# Altium project ADC_Klipper_Board.PrjPcb
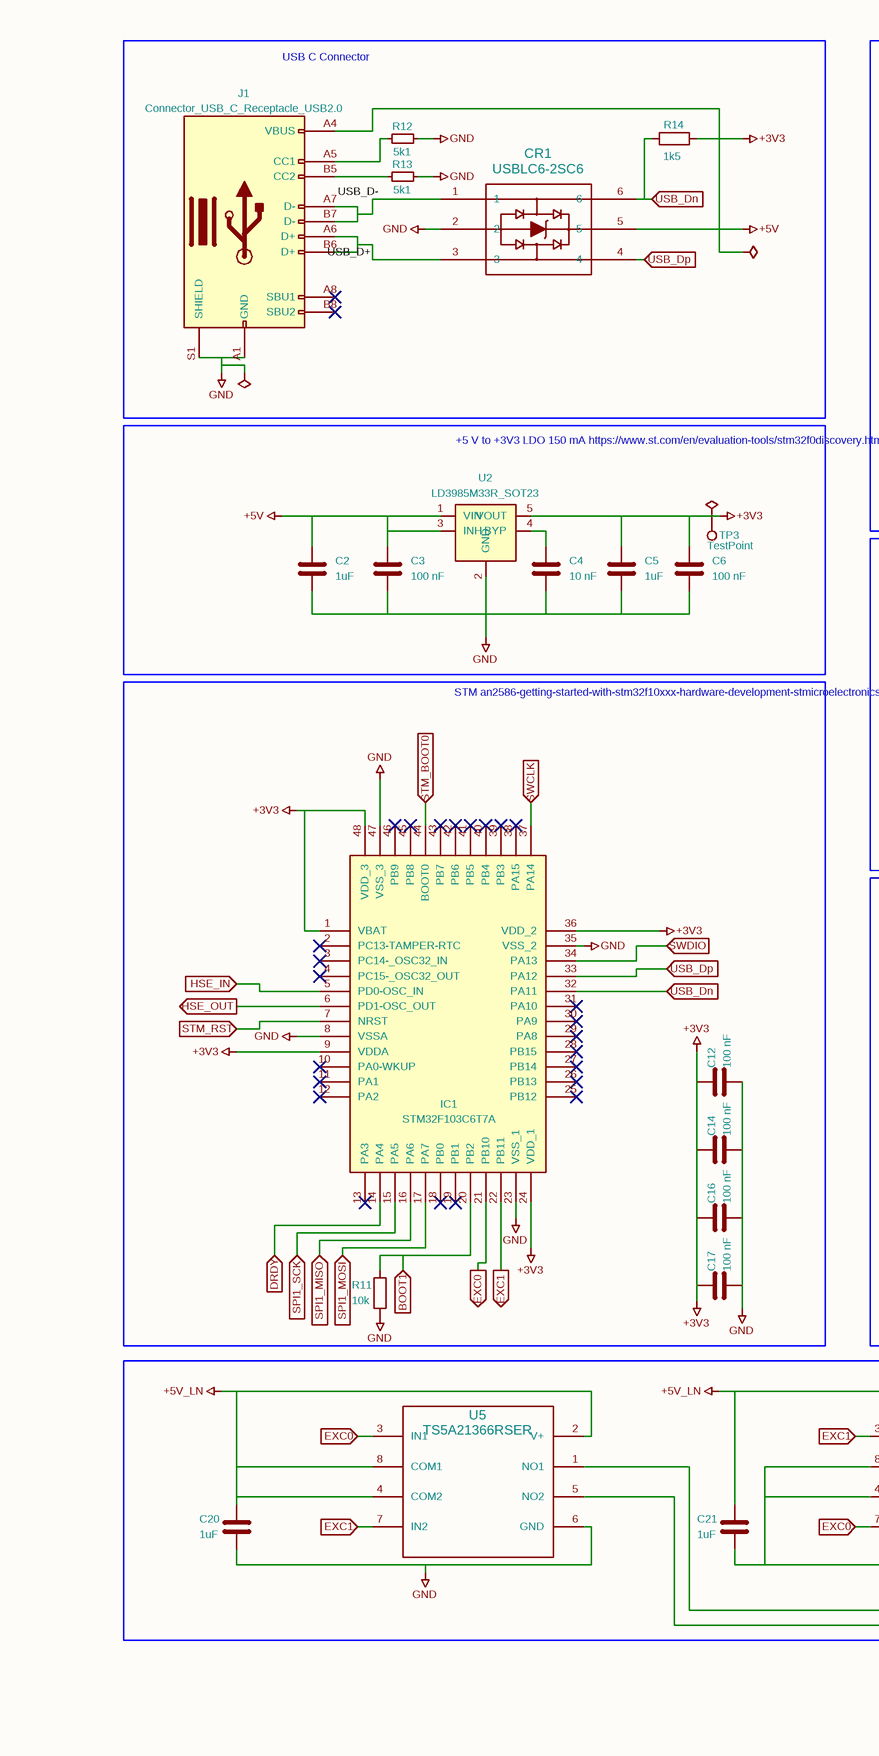
[diagram p0: ADC_Klipper_Board.SchDoc, left]
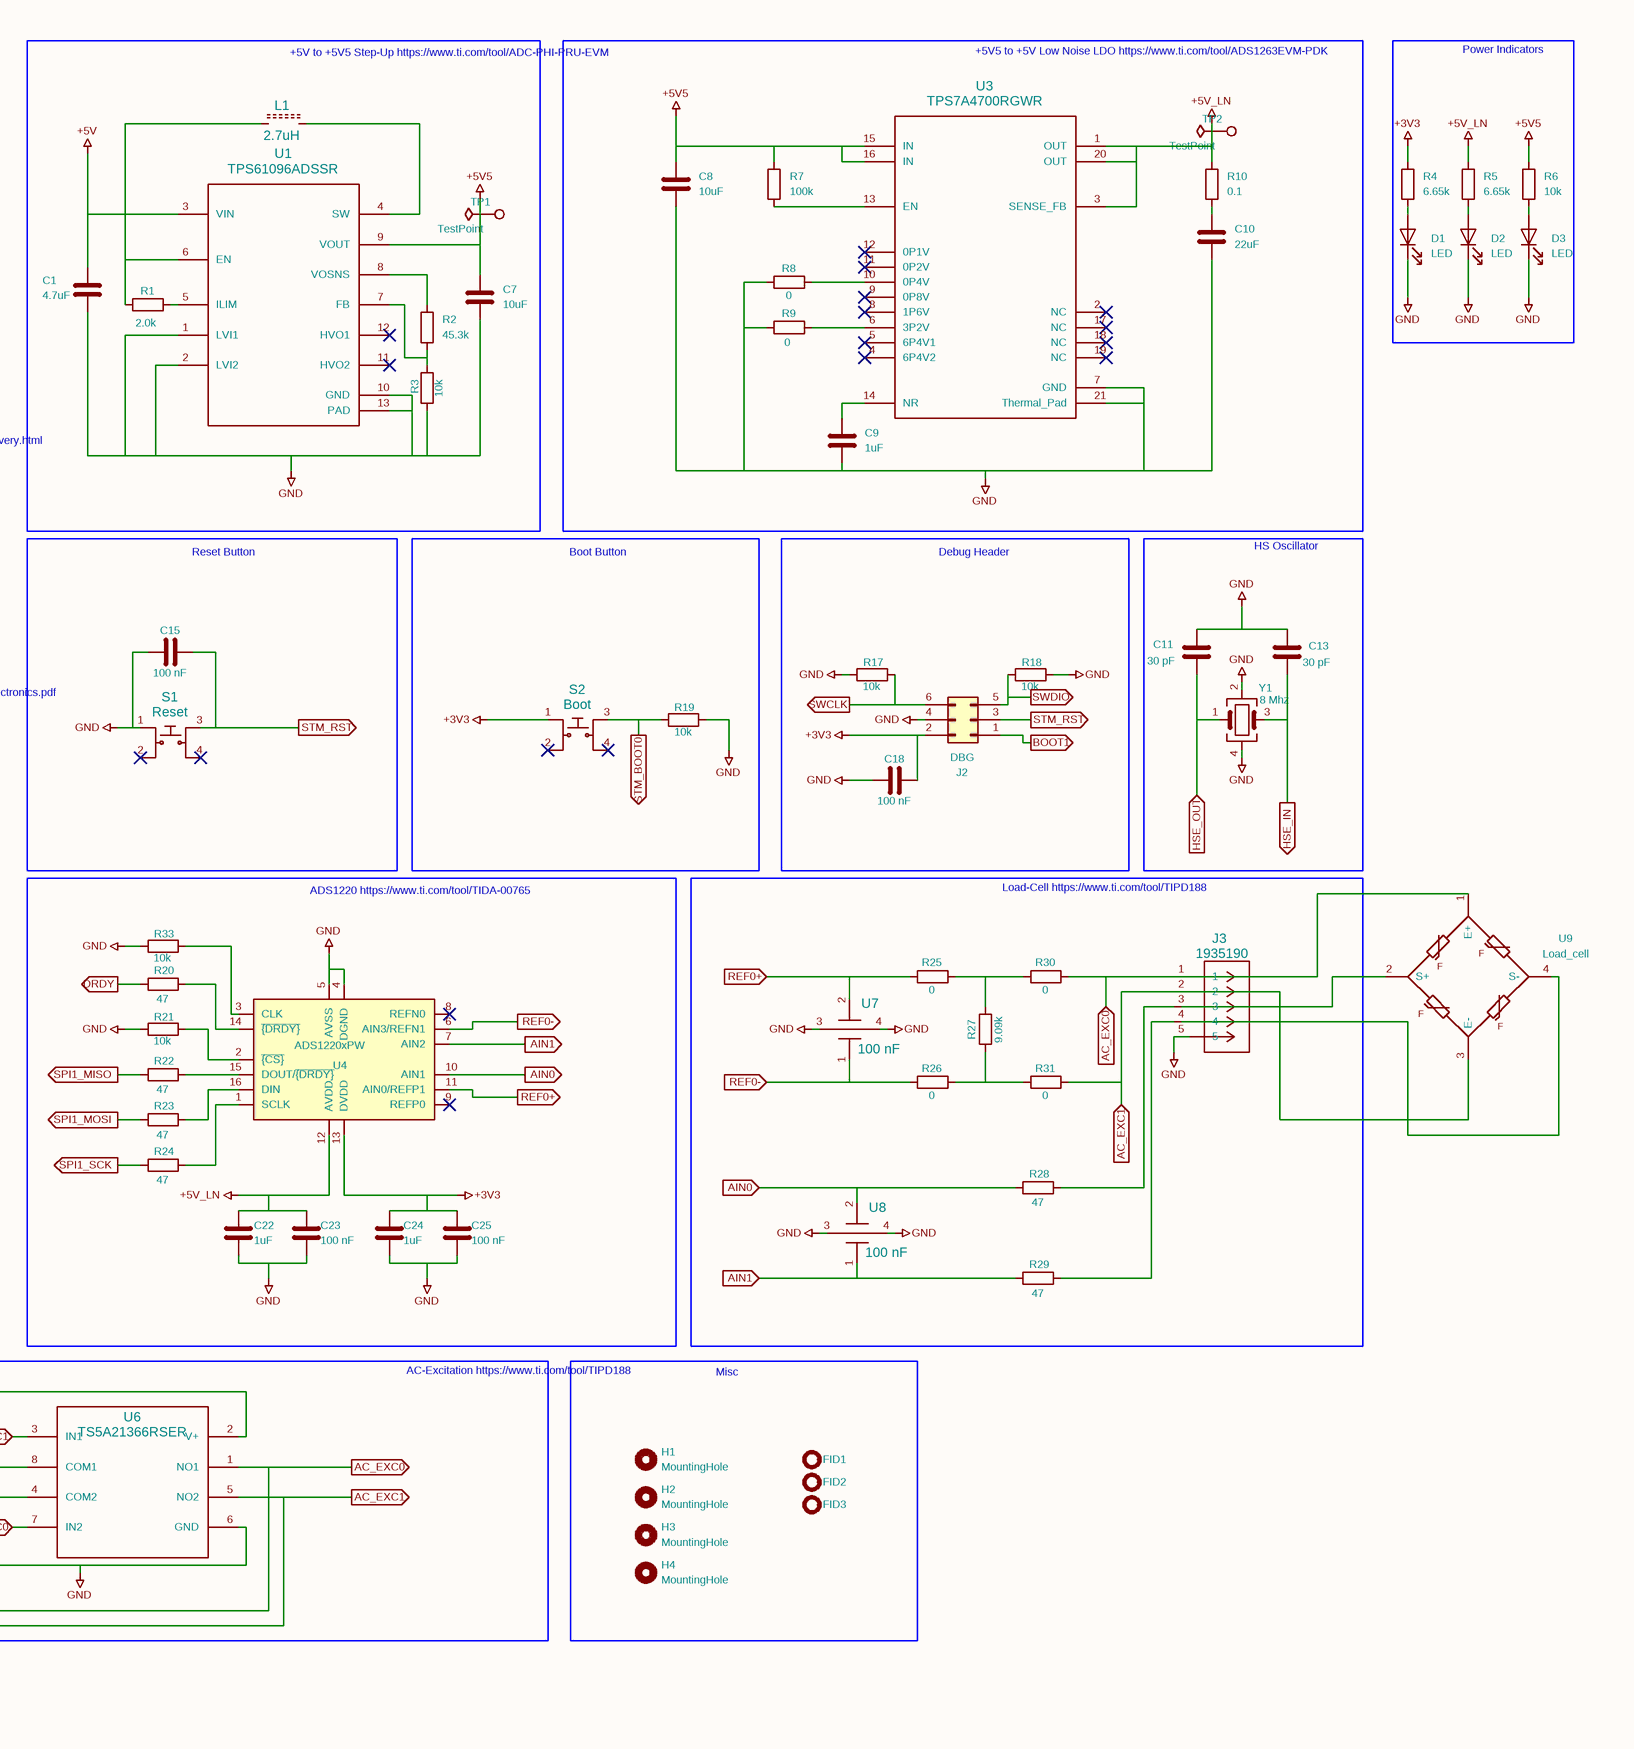
[diagram p1: ADC_Klipper_Board.SchDoc, right]
1 sheet, 90 parts. Net scope: flat (ports and power ports of the same name join across sheets).
Board file: ADC_Klipper_Board.PcbDoc

## Sheet ADC_Klipper_Board.SchDoc
size 420 x 297 mm

### Parts
#FLG01  PWR_FLAG  (value not drawn)  (graphical)
#FLG02  PWR_FLAG  (value not drawn)  (graphical)
#FLG03  PWR_FLAG  (value not drawn)  (graphical)
#FLG04  PWR_FLAG  (value not drawn)  (graphical)
#FLG05  PWR_FLAG  (value not drawn)  (graphical)
C1  4.7uF  [C_0805_2012Metric]
C2  1uF  [C_0603_1608Metric]
C3  100 nF  [C_0603_1608Metric]
C4  10 nF  [C_0603_1608Metric]
C5  1uF  [C_0603_1608Metric]
C6  100 nF  [C_0603_1608Metric]
C7  10uF  [C_1206_3216Metric]
C8  10uF  [C_1206_3216Metric]
C9  1uF  [C_0603_1608Metric]
C10  22uF  [C_1210_3225Metric]
C11  30 pF  [C_0603_1608Metric]
C12  100 nF  [C_0603_1608Metric]
C13  30 pF  [C_0603_1608Metric]
C14  100 nF  [C_0603_1608Metric]
C15  100 nF  [C_0603_1608Metric]
C16  100 nF  [C_0603_1608Metric]
C17  100 nF  [C_0603_1608Metric]
C18  100 nF  [C_0603_1608Metric]
C20  1uF  [C_0603_1608Metric]
C21  1uF  [C_0603_1608Metric]
C22  1uF  [C_0603_1608Metric]
C23  100 nF  [C_0603_1608Metric]
C24  1uF  [C_0603_1608Metric]
C25  100 nF  [C_0603_1608Metric]
CR1  USBLC6-2SC6  [SOT23-6L_STM]
D1  LED  [LED_0805_2012Metric]
D2  LED  [LED_0805_2012Metric]
D3  LED  [LED_0805_2012Metric]
FID1  Fiducial  [Fiducial_1mm_Mask2mm]  (value not drawn)
FID2  Fiducial  [Fiducial_1mm_Mask2mm]  (value not drawn)
FID3  Fiducial  [Fiducial_1mm_Mask2mm]  (value not drawn)
H1  MountingHole  [MountingHole_3.2mm_M3_ISO7380]
H2  MountingHole  [MountingHole_3.2mm_M3_ISO7380]
H3  MountingHole  [MountingHole_3.2mm_M3_ISO7380]
H4  MountingHole  [MountingHole_3.2mm_M3_ISO7380]
IC1  STM32F103C6T7A  [QFP50P900X900X160-48N]
J1  Connector_USB_C_Receptacle_USB2.0  [TYPE-C-31-M-12]
J2  DBG  [PinHeader_2x03_P2.54mm_Vertical]
J3  1935190  [CONN_1935190_PXC]
L1  2.7uH  [IND_5028_TDK]
R1  2.0k  [R_0603_1608Metric]
R2  45.3k  [R_0603_1608Metric]
R3  10k  [R_0603_1608Metric]
R4  6.65k  [R_0603_1608Metric]
R5  6.65k  [R_0603_1608Metric]
R6  10k  [R_0603_1608Metric]
R7  100k  [R_0603_1608Metric]
R8  0  [R_0603_1608Metric]
R9  0  [R_0603_1608Metric]
R10  0.1  [R_0603_1608Metric]
R11  10k  [R_0603_1608Metric]
R12  5k1  [R_0603_1608Metric]
R13  5k1  [R_0603_1608Metric]
R14  1k5  [R_0603_1608Metric]
R17  10k  [R_0603_1608Metric]
R18  10k  [R_0603_1608Metric]
R19  10k  [R_0603_1608Metric]
R20  47  [R_0603_1608Metric]
R21  10k  [R_0603_1608Metric]
R22  47  [R_0603_1608Metric]
R23  47  [R_0603_1608Metric]
R24  47  [R_0603_1608Metric]
R25  0  [R_0603_1608Metric]
R26  0  [R_0603_1608Metric]
R27  9.09k  [R_0603_1608Metric]
R28  47  [R_0603_1608Metric]
R29  47  [R_0603_1608Metric]
R30  0  [R_0603_1608Metric]
R31  0  [R_0603_1608Metric]
R33  10k  [R_0603_1608Metric]
S1  Reset  [SWITCH_43SMTR92LFS]
S2  Boot  [SWITCH_43SMTR92LFS]
TP1  TestPoint  [TestPoint_Pad_D2.0mm]
TP2  TestPoint  [TestPoint_Pad_D2.0mm]
TP3  TestPoint  [TestPoint_Pad_D2.0mm]
U1  TPS61096ADSSR  [DSS0012A]
U2  LD3985M33R_SOT23  [SOT-23-5]
U3  TPS7A4700RGWR  [RGW0020A-IPC_A]
U4  ADS1220xPW  [SOP65P640X120-16N]
U5  TS5A21366RSER  [RSE0008A]
U6  TS5A21366RSER  [RSE0008A]
U7  100 nF  [X15]
U8  100 nF  [X15]
U9  Load_cell
Y1  8 Mhz  [Crystal_SMD_5032-4Pin_5.0x3.2mm]

### Blocks framed on the sheet
USB C Connector: #FLG01 #FLG02 CR1 J1 R12-R14
+5V to +5V5 Step-Up / https://www.ti.com/tool/ADC-PHI-PRU-EVM: #FLG04 C1 C7 L1 R1-R3 TP1 U1
Power Indicators: D1-D3 R4-R6
Reset Button: C15 S1
Boot Button: R19 S2
Debug Header: C18 J2 R17 R18
HS Oscillator: C11 C13 Y1
ADS1220 / https://www.ti.com/tool/TIDA-00765: C22-C25 R20-R24 R33 U4
Load-Cell / https://www.ti.com/tool/TIPD188: J3 R25-R31 U7 U8
AC-Excitation / https://www.ti.com/tool/TIPD188: C20 C21 U5 U6
Misc /: FID1-FID3 H1-H4

### Ports
AC_EXC0 (in), AC_EXC0 (out), AC_EXC1 (in), AC_EXC1 (out), AIN0 (in), AIN0 (out), AIN1 (in), AIN1 (out), BOOT1 (in), BOOT1 (out), DRDY (in), DRDY (out), EXC0 (in), EXC0 (out), EXC1 (in), EXC1 (out), HSE_IN (in), HSE_IN (out), HSE_OUT (in), HSE_OUT (out), REF0+ (in), REF0+ (out), REF0- (in), REF0- (out), SPI1_MISO (in), SPI1_MISO (out), SPI1_MOSI (in), SPI1_MOSI (out), SPI1_SCK (in), SPI1_SCK (out), STM_BOOT0 (in), STM_BOOT0 (out), STM_RST (in), STM_RST (out), SWCLK (in), SWCLK (out), SWDIO (in), SWDIO (out), USB_Dn (in), USB_Dp (in)

### Nets
+3V3: #FLG03.1 C5.1 C6.1 C12.1 C14.1 C16.1 C17.1 C18.2 C24.1 C25.1 IC1.1(VBAT) IC1.9(VDDA) IC1.24(VDD_1) IC1.36(VDD_2) IC1.48(VDD_3) J2.2(Pin_2) R4.1 R14.2 S2.1 TP3.1 U2.5(VOUT) U4.13(DVDD)
+5V: #FLG02.1 C1.1 C2.1 C3.1 CR1.5 J1.A4(VBUS) L1.1 R1.1 U1.3(VIN) U1.6(EN) U2.1(VIN) U2.3(INH)
+5V5: #FLG04.1 C7.1 C8.1 R6.1 R7.1 TP1.1 U1.9(VOUT) U3.15(IN) U3.16(IN)
+5V_LN: #FLG05.1 C20.1 C21.1 C22.1 C23.1 R5.1 R10.1 TP2.1 U3.1(OUT) U3.3(SENSE_FB) U3.20(OUT) U4.12(AVDD) U5.2(V+) U5.4(COM2) U5.8(COM1) U6.2(V+)
GND: #FLG01.1 C1.2 C2.2 C3.2 C4.2 C5.2 C6.2 C7.2 C8.2 C9.2 C10.2 C11.1 C12.2 C13.1 C14.2 C15.1 C16.2 C17.2 C18.1 C20.2 C21.2 C22.2 C23.2 C24.2 C25.2 CR1.2 D1.1(K) D2.1(K) D3.1(K) IC1.8(VSSA) IC1.23(VSS_1) IC1.35(VSS_2) IC1.47(VSS_3) J1.A1(GND) J1.S1(SHIELD) J2.4(Pin_4) J3.5 R3.1 R8.2 R9.2 R11.2 R12.1 R13.1 R17.1 R18.2 R19.2 R21.1 R33.1 S1.1 U1.1(LVI1) U1.2(LVI2) U1.10(GND) U1.13(PAD) U2.2(GND) U3.7(GND) U3.21(Thermal_Pad) U4.4(DGND) U4.5(AVSS) U5.6(GND) U6.4(COM2) U6.6(GND) U6.8(COM1) U7.3 U7.4 U8.3 U8.4 Y1.2 Y1.4
AC_EXC0: J3.1 R30.1 U5.1(NO1) U6.1(NO1) U9.1(E+) ; port AC_EXC0
AC_EXC1: J3.2 R31.1 U5.5(NO2) U6.5(NO2) U9.3(E-) ; port AC_EXC1
AIN0: R28.1 U4.10(AIN1) U8.2 ; port AIN0
AIN1: R29.1 U4.7(AIN2) U8.1 ; port AIN1
BOOT1: IC1.20(PB2) J2.1(Pin_1) R11.1 ; port BOOT1
DRDY: IC1.14(PA4) R20.1 ; port DRDY
EXC0: IC1.21(PB10) U5.3(IN1) U6.7(IN2) ; port EXC0
EXC1: IC1.22(PB11) U5.7(IN2) U6.3(IN1) ; port EXC1
HSE_IN: C13.2 IC1.5(PD0-OSC_IN) Y1.3 ; port HSE_IN
HSE_OUT: C11.2 IC1.6(PD1-OSC_OUT) Y1.1 ; port HSE_OUT
REF0+: R25.2 U4.11(AIN0/REFP1) U7.2 ; port REF0+
REF0-: R26.2 U4.6(AIN3/REFN1) U7.1 ; port REF0-
SPI1_MISO: IC1.16(PA6) R22.1 ; port SPI1_MISO
SPI1_MOSI: IC1.17(PA7) R23.1 ; port SPI1_MOSI
SPI1_SCK: IC1.15(PA5) R24.1 ; port SPI1_SCK
STM_BOOT0: IC1.44(BOOT0) R19.1 S2.3 ; port STM_BOOT0
STM_RST: C15.2 IC1.7(NRST) J2.3(Pin_3) S1.3 ; port STM_RST
SWCLK: IC1.37(PA14) J2.6(Pin_6) R17.2 ; port SWCLK
SWDIO: IC1.34(PA13) J2.5(Pin_5) R18.1 ; port SWDIO
USB_D+: CR1.3 J1.A6(D+) J1.B6(D+)
USB_D-: CR1.1 J1.A7(D-) J1.B7(D-)
USB_Dn: CR1.6 IC1.32(PA11) R14.1 ; port USB_Dn
USB_Dp: CR1.4 IC1.33(PA12) ; port USB_Dp
NetC4_1: C4.1 U2.4(BYP)
NetC9_1: C9.1 U3.14(NR)
NetC10_1: C10.1 R10.2
NetD1_2: D1.2(A) R4.2
NetD2_2: D2.2(A) R5.2
NetD3_2: D3.2(A) R6.2
NetJ1_A5: J1.A5(CC1) R12.2
NetJ1_B5: J1.B5(CC2) R13.2
NetJ3_3: J3.3 R28.2
NetJ3_4: J3.4 R29.2
NetL1_2: L1.2 U1.4(SW)
NetR1_2: R1.2 U1.5(ILIM)
NetR2_1: R2.1 U1.8(VOSNS)
NetR2_2: R2.2 R3.2 U1.7(FB)
NetR7_2: R7.2 U3.13(EN)
NetR8_1: R8.1 U3.10(0P4V)
NetR9_1: R9.1 U3.6(3P2V)
NetR20_2: R20.2 U4.14(~{{DRDY}})
NetR21_2: R21.2 U4.2(~{{CS}})
NetR22_2: R22.2 U4.15(DOUT/~{{DRDY}})
NetR23_2: R23.2 U4.16(DIN)
NetR24_2: R24.2 U4.1(SCLK)
NetR25_1: R25.1 R27.1 R30.2
NetR26_1: R26.1 R27.2 R31.2
NetR33_2: R33.2 U4.3(CLK)

Not connected (* = marked no-connect by the designer): IC1 2(PC13-TAMPER-RTC)* 3(PC14-_OSC32_IN)* 4(PC15-_OSC32_OUT)* 10(PA0-WKUP)* 11(PA1)* 12(PA2)* 13(PA3)* 18(PB0)* 19(PB1)* 25(PB12)* 26(PB13)* 27(PB14)* 28(PB15)* 29(PA8)* 30(PA9)* 31(PA10)* 38(PA15)* 39(PB3)* 40(PB4)* 41(PB5)* 42(PB6)* 43(PB7)* 45(PB8)* 46(PB9)*; J1 A8(SBU1)* A9(VBUS) A12(GND) B1(GND) B4(VBUS) B8(SBU2)* B9(VBUS) B12(GND); S1 2* 4*; S2 2* 4*; U1 11(HVO2)* 12(HVO1)*; U3 2(NC)* 4(6P4V2)* 5(6P4V1)* 8(1P6V)* 9(0P8V)* 11(0P2V)* 12(0P1V)* 17(NC)* 18(NC)* 19(NC)*; U4 8(REFN0)* 9(REFP0)*; U9 2(S+) 4(S-)

### Notes on the sheet
- +5V5 to +5V Low Noise LDO
  https://www.ti.com/tool/ADS1263EVM-PDK
- +5 V to +3V3 LDO 150 mA
  https://www.st.com/en/evaluation-tools/stm32f0discovery.html
- STM
  an2586-getting-started-with-stm32f10xxx-hardware-development-stmicroelectronics.pdf
- 1
- 2
- 3
- 4
- 5
- 6
- 7
- 8
- A
- B
- C
- D
- E
- Title:
- File: ADC_Klipper_Board.kicad_sch
- Sheet: /
- F
- KiCad E.D.A.  kicad (5.1.4)-1
- Size: A3
- Date:
- Rev:
- Id: 1/1
- (in symbol Load_cell) F

### Library data of the parts
#FLG01 #FLG02 #FLG03 #FLG04 #FLG05 = PWR_FLAG: Description: Special symbol for telling ERC where power comes from; Value: PWR_FLAG
C1 = C: Manufacturer: Murata; Manufacturer_Part_Number: GRM21BR71A475KE51L; Description: Unpolarized capacitor; LCSC: C415536; Value: 4.7uF; Footprint: Capacitor_SMD:C_0805_2012Metric
C2 C5 C9 C20-C22 C24 = C: Manufacturer: Murata; Manufacturer_Part_Number: GCJ188R71E105KA01D; Description: Unpolarized capacitor; LCSC: C908553; Value: 1uF; Footprint: Capacitor_SMD:C_0603_1608Metric
C3 C6 C12 C14-C18 C23 C25 = C: Manufacturer: Yageo; Manufacturer_Part_Number: CC0603KRX7R7BB104; Description: Unpolarized capacitor; LCSC: C108079; Value: 100 nF; Footprint: Capacitor_SMD:C_0603_1608Metric
C4 = C: Manufacturer: Yageo; Manufacturer_Part_Number: CC0603KRX7R9BB103; Description: Unpolarized capacitor; LCSC: C100042; Value: 10 nF; Footprint: Capacitor_SMD:C_0603_1608Metric
C7 C8 = C: Manufacturer: Kemet; Manufacturer_Part_Number: C1206C106K3RACTU; Description: Unpolarized capacitor; LCSC: C2168111; Value: 10uF; Footprint: Capacitor_SMD:C_1206_3216Metric
C10 = C: Manufacturer: Murata; Manufacturer_Part_Number: GRM32ER71E226KE15L; Description: Unpolarized capacitor; LCSC: C21397; Value: 22uF; Footprint: Capacitor_SMD:C_1210_3225Metric
C11 C13 = C: Manufacturer: Yageo; Manufacturer_Part_Number: AC0603JRNPO9BN300; Description: Unpolarized capacitor; LCSC: C2191217; Value: 30 pF; Footprint: Capacitor_SMD:C_0603_1608Metric
D1-D3 = LED: Manufacturer: Kingbright; Manufacturer_Part_Number: APT2012LZGCK; Description: Light emitting diode; LCSC: C5569446; Value: LED; Footprint: LED_SMD:LED_0805_2012Metric
FID1-FID3 = Fiducial: Description: Fiducial Marker; Value: Fiducial; Footprint: Fiducial:Fiducial_1mm_Mask2mm
H1-H4 = MountingHole: Description: Mounting Hole without connection; Value: MountingHole; Footprint: MountingHole:MountingHole_3.2mm_M3_ISO7380
IC1 = STM32F103C6T7A: Manufacturer: STMicroelectronics; Description: STM32F103C6T7A, 32 bit ARM Cortex M3 Microcontroller 72MHz 32 kB Flash, 10 kB RAM, USB CAN I2C 48-Pin LQFP; Manufacturer_Part_Number: STM32F103C6T7A; LCSC: C222074; Value: STM32F103C6T7A; Footprint: STM32F103C6T7A:QFP50P900X900X160-48N
J1 = Connector_USB_C_Receptacle_USB2.0: Manufacturer: Korean Hroparts Elec; LCSC: C5337088; Manufacturer_Part_Number: TYPE-C-31-M-12; Value: Connector_USB_C_Receptacle_USB2.0; Footprint: USB-C-Power-tester:TYPE-C-31-M-12
J2 = Conn_02x03_Odd_Even: Manufacturer: BOOMELE; Manufacturer_Part_Number: 2.54-2*3P; LCSC: C65114; Value: DBG; Footprint: Connector_PinHeader_2.54mm:PinHeader_2x03_P2.54mm_Vertical
J3 = 1935190: Manufacturer: Phoenix Contact; LCSC: C6047339; Manufacturer_Part_Number: 1935190; Value: 1935190; Footprint: 1935190:CONN_1935190_PXC
L1 = L_Ferrite: Manufacturer: TDK; Manufacturer_Part_Number: VLCF5020T-2R7N1R7; Description: Inductor with ferrite core; LCSC: C307836; Value: 2.7uH; Footprint: VLCF5020T-2R7N1R7:IND_5028_TDK
R1 = R: Manufacturer: EYANG; Manufacturer_Part_Number: R0603RXX202XF10LTS; Description: Resistor; LCSC: C267576; Value: 2.0k; Footprint: Resistor_SMD:R_0603_1608Metric
R2 = R: Manufacturer: Panasonic; Manufacturer_Part_Number: ERJ3EKF4532V; Description: Resistor; LCSC: C403233; Value: 45.3k; Footprint: Resistor_SMD:R_0603_1608Metric
R3 R6 R11 R17-R19 R21 R33 = R: Manufacturer: Yageo; Manufacturer_Part_Number: RT0603FRE0710KL; Description: Resistor; LCSC: C469659; Value: 10k; Footprint: Resistor_SMD:R_0603_1608Metric
R4 R5 = R: Manufacturer: Yageo; Manufacturer_Part_Number: AC0603FR-076K65L; Description: Resistor; LCSC: C228025; Value: 6.65k; Footprint: Resistor_SMD:R_0603_1608Metric
R7 = R: Manufacturer: Yageo; Manufacturer_Part_Number: RT0603FRE07100KL; Description: Resistor; LCSC: C728638; Value: 100k; Footprint: Resistor_SMD:R_0603_1608Metric
R8 R9 R25 R26 R30 R31 = R: Manufacturer: Yageo; Manufacturer_Part_Number: RC0603JR-070RL; Description: Resistor; LCSC: C95177; Value: 0; Footprint: Resistor_SMD:R_0603_1608Metric
R10 = R: Manufacturer: ROHM Semicon; Manufacturer_Part_Number: UCR03EVPFLR100; Description: Resistor; LCSC: C880952; Value: 0.1; Footprint: Resistor_SMD:R_0603_1608Metric
R12 R13 = R_Small: Manufacturer: Vishay; Manufacturer_Part_Number: CRCW06035K10FKEA; LCSC: C844933; Value: 5k1; Footprint: Resistor_SMD:R_0603_1608Metric
R14 = R: Manufacturer: KAMAYA; Manufacturer_Part_Number: RMC1/16K152FTP; Description: Resistor; LCSC: C340503; Value: 1k5; Footprint: Resistor_SMD:R_0603_1608Metric
R20 R22-R24 R28 R29 = R: Manufacturer: Vishay; Manufacturer_Part_Number: CRCW060347R0FKEA; Description: Resistor; LCSC: C511383; Value: 47; Footprint: Resistor_SMD:R_0603_1608Metric
R27 = R: Manufacturer: Panasonic; Manufacturer_Part_Number: ERJ-3EKF9091V; Description: Resistor; Value: 9.09k; Footprint: Resistor_SMD:R_0603_1608Metric
S1 S2 = PTS645SM43SMTR92_LFS: Manufacturer: C&K; Description: SWITCH TACTILE SPST-NO 0.05A 12V; LCSC: C221880; Manufacturer_Part_Number: PTS645SM43SMTR92; Footprint: PTS645SM43SMTR92_LFS:SWITCH_43SMTR92LFS
  S1: Value: Reset
  S2: Value: Boot
U2 = LD3985M33R_SOT23: Description: 150mA Low Dropout Voltage Regulator, Fixed Output 3.3V, SOT-23-5; LCSC: C46243; Manufacturer_Part_Number: LD3985M33R; Value: LD3985M33R_SOT23; Footprint: Package_TO_SOT_SMD:SOT-23-5
U4 = ADS1220xPW: Description: Low-power, quad-input, 24-bit analog to digital converter, integrated temperature sensor, SPI interface, TSSOP-16 package; LCSC: C48263; Manufacturer_Part_Number: ADS1220xPW; Value: ADS1220xPW; Footprint: ADS1220IPWR:SOP65P640X120-16N
U7 U8 = 250X15W104MV4E: Manufacturer: Johanson Dielectrics Inc.; LCSC: C111274; Manufacturer_Part_Number: 250X15W104MV4E; Value: 100 nF; Footprint: 250X15W104MV4E:X15
U9 = Load_cell: Description: 4-wire load cell for weigh scales; Value: Load_cell
Y1 = Crystal_GND24: Manufacturer: YXC Crystal Oscillators; Manufacturer_Part_Number: XL1SI-111-8M; Description: Four pin crystal, GND on pins 2 and 4; LCSC: C20617600; Value: 8 Mhz; Footprint: Crystal:Crystal_SMD_5032-4Pin_5.0x3.2mm
CR1 = USBLC6-2SC6: LCSC: C2827654; Manufacturer_Part_Number: USBLC6-2SC6; Value: USBLC6-2SC6; Footprint: USBLC6_2SC6:SOT23-6L_STM
TP1-TP3 = TestPoint: Description: test point; Value: TestPoint; Footprint: TestPoint:TestPoint_Pad_D2.0mm
U1 = TPS61096ADSSR: LCSC: C2862062; Manufacturer_Part_Number: TPS61096ADSSR; Value: TPS61096ADSSR; Footprint: TPS61096ADSSR:DSS0012A
U3 = TPS7A4700RGWR: LCSC: C114839; Manufacturer_Part_Number: TPS7A4700RGWR; Value: TPS7A4700RGWR; Footprint: TPS7A4700RGWR:RGW0020A-IPC_A
U5 U6 = TS5A21366RSER: Manufacturer_Part_Number: TS5A21366RSER; Value: TS5A21366RSER; Footprint: TS5A21366RSER:RSE0008A